# EAGLE design RNG_Board (EAGLE 9.5.0)

## Sheet 1 of 2
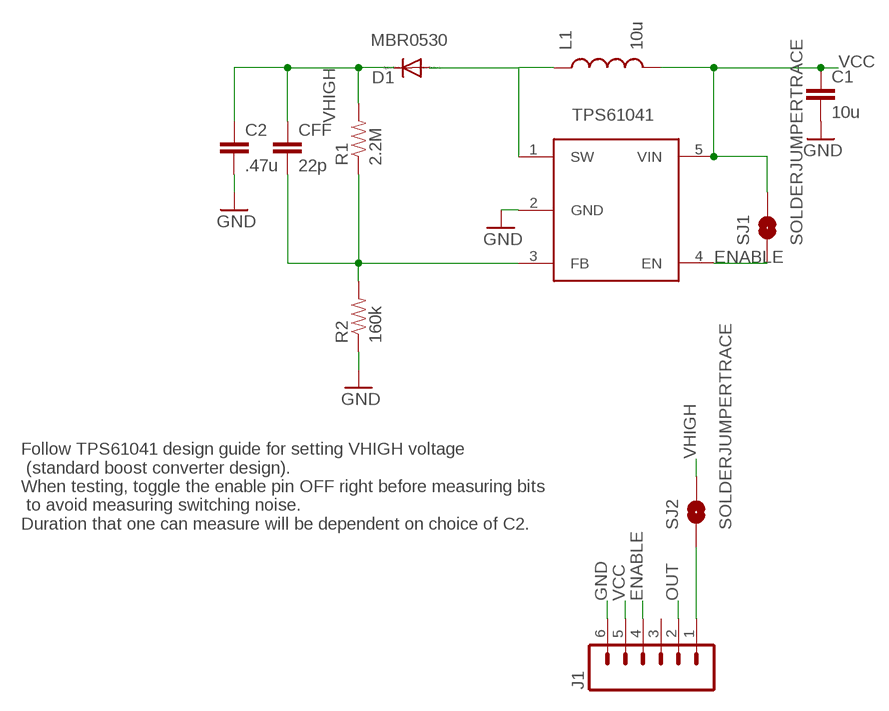
[diagram p0: schematic, sheet 1]

### Parts
C1  10u  CAP0603-CAP  [0603-CAP]
C2  .47u  CAP0603-CAP  [0603-CAP]
CFF  22p  CAP0603-CAP  [0603-CAP]
D1  MBR0530  CGRM4001-G  [SOD-123_MINI-SMA]
J1  M06SILK_FEMALE_PTH  [1X06]
L1  10u  INDUCTOR0805  [0805]
R1  2.2M  0.27OHM-1/10W-1%(0603)  [0603-RES]
R2  160k  0.27OHM-1/10W-1%(0603)  [0603-RES]
SJ1  SOLDERJUMPERTRACE  [SJ_2S-TRACE]
SJ2  SOLDERJUMPERTRACE  [SJ_2S-TRACE]
U$1  TPS61040  [SOT23-5]

### Nets
ENABLE: J1.4 SJ1.1 U$1.4(EN)
GND: C1.2 C2.2 J1.6 R2.1 U$1.2(GND) ; also sheet 2
N$1: CFF.2 R1.1 R2.2 U$1.3(FB)
N$2: D1.A L1.1 U$1.1(SW)
N$10: J1.1 SJ2.1
OUT: J1.2 ; also sheet 2
VCC: C1.1 J1.5 L1.2 SJ1.2 U$1.5(VIN) ; also sheet 2
VHIGH: C2.1 CFF.1 D1.C R1.2 SJ2.2 ; also sheet 2
Unconnected: J1.3

### Notes on the sheet
- TPS61041
- Follow TPS61041 design guide for setting VHIGH voltage
   (standard boost converter design).
  When testing, toggle the enable pin OFF right before measuring bits
   to avoid measuring switching noise. 
  Duration that one can measure will be dependent on choice of C2.

## Sheet 2 of 2
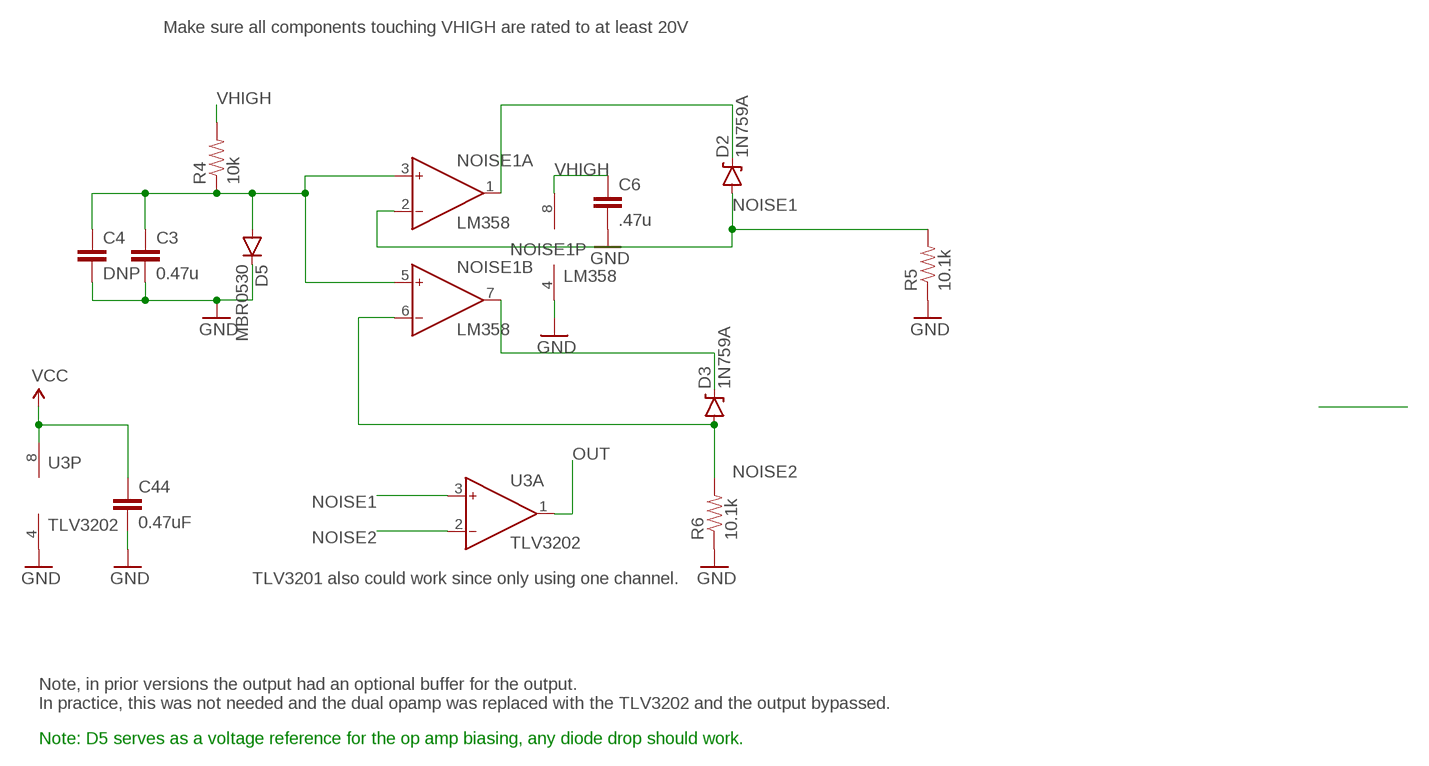
[diagram p1: schematic, sheet 2]

### Parts
C3  0.47u  CAP0603-CAP  [0603-CAP]
C4  DNP  CAP0603-CAP  [0603-CAP]
C6  .47u  CAP0603-CAP  [0603-CAP]
C44  0.47uF  C-EUC0603  [C0603]
D2  1N759A  DIODE-ZENERPTH  [DIODE-ZENER]
D3  1N759A  DIODE-ZENERPTH  [DIODE-ZENER]
D5  MBR0530  DIODESOD123  [SOD-123]
NOISE1  LM358  AD712R  [SO8]
R4  10k  RESISTOR0603  [0603-RES]
R5  10.1k  RESISTOR0603  [0603-RES]
R6  10.1k  RESISTOR0603  [0603-RES]
U3  TLV3202  AD712R  [SO8]

### Nets
GND: C3.2 C4.2 C6.2 C44.2 D5.C NOISE1.4(P:V-) R5.1 R6.1 U3.4(P:V-) ; also sheet 1
N$4: D2.P$1(C) NOISE1.1(A:OUT)
N$5: D3.P$1(C) NOISE1.7(B:OUT)
N$9: C3.1 C4.1 D5.A NOISE1.3(A:IN+) NOISE1.5(B:IN+) R4.1
NOISE1: D2.P$2(A) NOISE1.2(A:IN-) R5.2 U3.3(A:IN+)
NOISE2: D3.P$2(A) NOISE1.6(B:IN-) R6.2 U3.2(A:IN-)
OUT: U3.1(A:OUT) ; also sheet 1
VCC: C44.1 U3.8(P:V+) ; also sheet 1
VHIGH: C6.1 NOISE1.8(P:V+) R4.2 ; also sheet 1
Unconnected: U3.5(B:IN+) U3.6(B:IN-) U3.7(B:OUT)

### Notes on the sheet
- Make sure all components touching VHIGH are rated to at least 20V
- TLV3201 also could work since only using one channel.
- Note, in prior versions the output had an optional buffer for the output.
  In practice, this was not needed and the dual opamp was replaced with the TLV3202 and the output bypassed.
- Note: D5 serves as a voltage reference for the op amp biasing, any diode drop should work.

## Library data of the parts
C1 C2 C6 CFF = SparkFun-Capacitors:CAP: Capacitor Standard 0603 ceramic capacitor, and 0.1" leaded capacitor.
C3 C4 = SparkFun-Passives:CAP: Capacitor Standard 0603 ceramic capacitor, and 0.1" leaded capacitor.
C44 = imix:C-EU: CAPACITOR, European symbol
D1 = diode:CGRM400*-G: Molded plasitc,JEDEC SOD-123/Mini SMA Source: Comchip CGRM4001-G.pdf
D2 D3 = imix:DIODE-ZENER: Zener Diode Production Part - 8199 3.4V Zener Voltage; MPN: 610-1N759A
D5 = imix:DIODE: Diode These are standard reverse protection diodes and small signal diodes. SMA package can handle up to about 1A. SOD-323 can handle about 200mA. What the SOD-323 package when ordering, there are some mfgs out there that are 5-pin packages.; DKPN: MBR0530CT-ND
J1 = SparkFun-Connectors:M06: Header 6 Standard 6-pin 0.1" header. Use with straight break away headers (SKU : PRT-00116), right angle break away headers (PRT-00553), swiss pins (PRT-00743), machine pins (PRT-00117), and female headers (PRT-00115). Molex polarized connector foot print use with SKU : PRT-08094 with associated crimp pins and housings. NOTES ON THE VARIANTS LOCK and LOCK_LONGPADS... This footprint was designed to help hold the alignment of a through-hole component (i.e. 6-pin header) while soldering it into place. You may notice that each hole has been shifted either up or down by 0.005 of an inch from it's more standard position (which is a perfectly straight line). This slight alteration caused the pins (the squares in the middle) to touch the edges of the holes. Because they are alternating, it causes a "brace" to hold the component in place. 0.005 has proven to be the perfect amount of "off-center" position when using our standard breakaway headers. Although looks a little odd when you look at the bare footprint, once you have a header in there, the alteration is very hard to notice. Also,if you push a header all the way into place, it is covered up entirely on the bottom side. This idea of altering the position of holes to aid alignment will be further integrated into the Sparkfun Library for other footprints. It can help hold any component with 3 or more connection pins.; PROD_ID: CONN-08437
L1 = SparkFun-Passives:INDUCTOR: Inductors Basic Inductor/Choke - 0603 and 1206. Footprints are not proven and vary greatly between part numbers. INDUCTOR POWER 3.3UH 4.0A SMD 0.197" L x 0.197" W x 0.177" H (5.00mm x 5.00mm x 4.50mm)
NOISE1 = analog-devices:AD712: Dual Precision, Low Cost, High Speed BiFET Op Amp Source: http://www.analog.com/static/imported-files/data_sheets/AD712.pdf; MF: ALTERA CORPORATION; MPN: AD712KRZ; OC_FARNELL: 1263975; OC_NEWARK: 59K4556
R1 R2 = SparkFun-Resistors:0.27OHM-1/10W-1%(0603): RES-08787; PROD_ID: RES-08787
R4-R6 = SparkFun-Resistors:RESISTOR: Resistor Basic schematic elements and footprints for 0603, 1206, and PTH resistors.
SJ1 SJ2 = SparkFun-Retired:SOLDERJUMPER: Solder Jumper Standard SMD solder jumper. Used to automate production. Two varients : Normally Open and Normally Closed are the same, but have different paste layers. NC will have a large amount of paste and should jumper during reflow.
U3 = imix:AD712: Dual Precision, Low Cost, High Speed BiFET Op Amp Source: http://www.analog.com/static/imported-files/data_sheets/AD712.pdf; DKPN: 296-34773-1-ND; MF: ALTERA CORPORATION; MPN: AD712KRZ; OC_FARNELL: 1263975; OC_NEWARK: 59K4556
U$1 = SparkFun-PowerIC:TPS61040: TPS61041 DC DC Custom

## Net classes
0 default: width 0.152 mm, drill 0.33 mm, clearance 0.152 mm
1 power: width 0.152 mm, drill 0.33 mm, clearance 0.254 mm

## Board
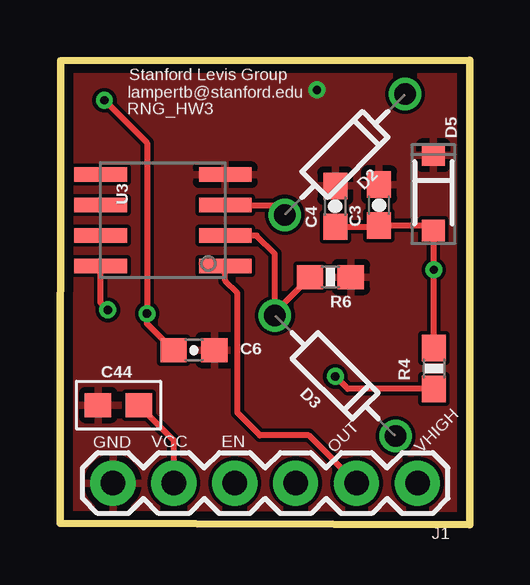
[diagram p2: board, top side]
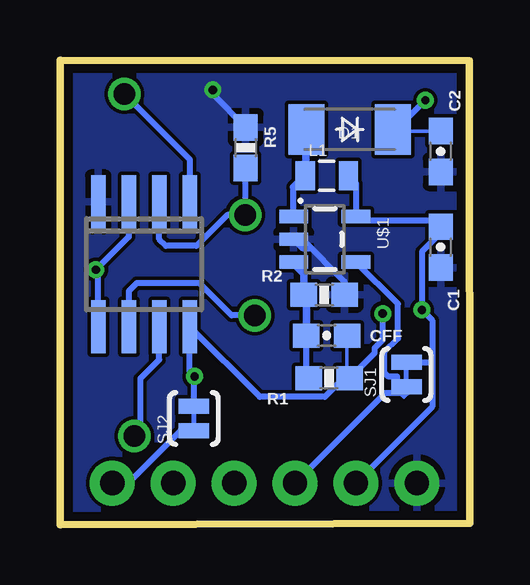
[diagram p3: board, bottom side, seen from below]

Size 17.09 x 19.35 mm. Coordinates in mm from the lower left corner, seen from the top.
Outline: 0,0.05 0.03,19.33 17.09,19.35 17.09,0 0,0.05
Copper layers (1*16): Top 0.0356mm / dielectric 1.5011mm / Bottom 0.0356mm
Design rules "LaenPCBOrder": minimum track width 6mil, minimum drill 13mil, track to track 6mil, track to pad 6mil, pad to pad 6mil, via to via 6mil, smd to smd 6mil, copper to edge 15mil, drill to drill 6mil, minimum pad ring 7mil, minimum via ring 7mil, stop-mask expansion 3mil, vias tented up to drill 0mil, thermal gap 10mil

### Footprints (pad centres in the part's own frame; a part is rotated, then mirrored left to right if it is on the bottom)
0603-CAP = smd 1.1 x 1: 1 -0.85,0; 2 0.85,0
C0603 = smd 1.1 x 1: 1 -0.85,0; 2 0.85,0
SOD-123_MINI-SMA = smd 1.5 x 2.1: A 1.8,0; C -1.8,0
DIODE-ZENER = drill 0.9: P$1 -3.556,0; P$2 3.556,0
SOD-123 = smd 0.9 x 0.95: A 1.575,0; C -1.575,0
1X06 = drill 1.016 pad 1.88: 1 0,0; 2 2.54,0; 3 5.08,0; 4 7.62,0; 5 10.16,0; 6 12.7,0
0805 = smd 0.8 x 1.2: 1 -0.9,0; 2 0.9,0
SO8 = smd 0.6 x 2.2: 1 -1.905,-2.6; 2 -0.635,-2.6; 3 0.635,-2.6; 4 1.905,-2.6; 5 1.905,2.6; 6 0.635,2.6; 7 -0.635,2.6; 8 -1.905,2.6
0603-RES = smd 1.1 x 1: 1 -0.85,0; 2 0.85,0
SJ_2S-TRACE = smd 0.635 x 1.27: 1 -0.508,0; 2 0.508,0
SOT23-5 = smd 0.55 x 1.2: 1 -0.95,-1.3; 2 0,-1.3; 3 0.95,-1.3; 4 0.95,1.3; 5 -0.95,1.3

### Placement (x,y rotation side)
C1  1.22,11.56 270 bottom
C2  1.22,15.54 270 bottom
C3  13.31,13.31 90 top
C4  11.48,13.26 90 top
C6  5.59,7.26 0 top
C44  2.44,4.98 180 top
CFF  5.97,7.87 180 bottom
D1  5,16.46 180 bottom
D2  11.89,15.42 225 top
D3  11.48,6.2 135 top
D5  15.57,13.82 270 top
J1  14.91,1.73 180 top
L1  5.97,14.53 0 bottom
NOISE1  13.59,10.85 180 bottom
R1  5.87,6.1 0 bottom
R2  6.07,9.58 180 bottom
R4  15.6,6.5 270 top
R5  9.35,15.7 270 bottom
R6  11.28,10.31 180 top
SJ1  2.64,6.25 90 bottom
SJ2  11.51,4.42 90 bottom
U3  4.29,12.67 90 top
U$1  6.05,11.89 270 bottom

### Tracks (layer width: path | path; a pad name or v marks a point on that pad's centre or on a via)
ENABLE
  Bottom 0.152: SJ1.1 2.43,5.61 2.74,5.3 3.06,5.61 2.99,5.68
  Bottom 0.254: J1.4 3.53,5.49 2.8,5.49 | 2.64,5.49 2.8,5.49 | 2.8,5.49 2.99,5.68 3.02,5.71 3.02,6.16 3.39,6.16 3.56,6.32 3.56,7.19 3,7.75 3,9.19 U$1.4
  Bottom 0.305: 7.06,1.73 J1.4
GND  (via drill 0.35)
  Bottom 0.254: R5.1 10.72,17.92 v10.72,18.11 | 6.63,11.49 6.95,11.49 U$1.2 6.99,11.89 5.22,10.12 R2.1 5.22,10.08
  pour Top: -2.03,24.51 -3.25,24.51 -3.25,-2.34 20.14,-2.34 20.14,23.95 -1.98,23.95 -1.98,24.51
  pour Bottom: -1.68,24.46 -2.95,24.46 -2.95,-2.39 22.68,-2.39 22.68,23.9 -1.68,23.9
N$1
  Bottom 0.254: R1.1 6.82,6.2 CFF.2
  Bottom 0.305: U$1.3 7.48,11.07 7.54,11.07 6.92,10.45 R2.2 6.82,9.47 CFF.2 6.72,7.77
N$2
  Bottom 0.254: U$1.1 7.35,14.05
  Bottom 0.305: 7.35,14.05 L1.1 6.91,14.57 6.91,14.68 6.86,14.73 D1.A
N$4
  Bottom 0.254: D2.P$1 11.68,15.21 NOISE1.1
N$5
  Bottom 0.254: NOISE1.7 12.95,6.87 13.74,6.08 13.74,3.93 D3.P$1
N$9  (via drill 0.35)
  Top 0.152: 15.56,12.23 D5.A
  Top 0.254: C4.1 13.26,12.41 C3.1 15.33,12.46 15.56,12.23 | D5.A 15.57,10.64 v15.6,10.62 R4.1
  Bottom 0.254: NOISE1.5 15.52,8.27 15.52,10.54 v15.6,10.62 14.22,11.99 NOISE1.3
N$10
  Bottom 0.254: SJ2.1 12.07,3.91 14.25,1.73 J1.1
NOISE1
  Top 0.254: U3.3 8.97,13.31 D2.P$2
  Bottom 0.254: 12.95,12.92 NOISE1.2 12.95,11.89 12.67,11.61 11.4,11.61 10.11,12.9 D2.P$2 9.37,14.82 R5.2
NOISE2
  Top 0.254: U3.2 8.2,12.04 8.97,11.28 D3.P$2 8.97,8.85 R6.2
  Bottom 0.254: D3.P$2 9.93,8.71 11.28,10.06 13.89,10.06 14.22,9.73 NOISE1.6
OUT
  Top 0.254: 12.19,1.73 J1.2 10.38,3.72 8.34,3.72 7.4,4.66 7.4,9.65 6.89,10.16 U3.1
VCC  (via drill 0.35)
  Top 0.254: C44.1 4.75,3.52 J1.5 | v2,8.94 1.69,9.25 U3.8
  Bottom 0.254: J1.5 1.57,4.91 1.57,6.73 | 1.57,6.73 1.57,8.51 v2,8.94 2,11.37 1.22,12.15 C1.1 1.49,12.67 4.58,12.67 U$1.5 4.75,14.21 L1.2 | SJ1.2 1.59,6.76 1.57,6.73
VHIGH  (via drill 0.35)
  Top 0.254: v1.85,17.68 3.63,15.9 v3.63,8.79 3.63,8.37 C6.1 | R4.2 12,5.65 v11.48,6.17
  Bottom 0.152: CFF.1 5.12,6.2 R1.2 | D1.C 3.18,16.43 3.14,16.39 C2.1
  Bottom 0.254: v1.85,17.68 3.1,16.43 3.18,16.43 | SJ2.2 11.51,6.15 v11.48,6.17 11.68,6.38 NOISE1.8 8.76,5.32 6.05,5.32 5.27,6.1 R1.2 3.96,7.15 3.96,7.36 3.63,7.69 v3.63,8.79

### Text on the board
tNames: lampertb@stanford.edu | Stanford Levis Group | RNG_HW3 | GND | VCC | EN | OUT | VHIGH